# Altium project LPL_Control_board_Rev4.PrjPcb (part 2 of 2)
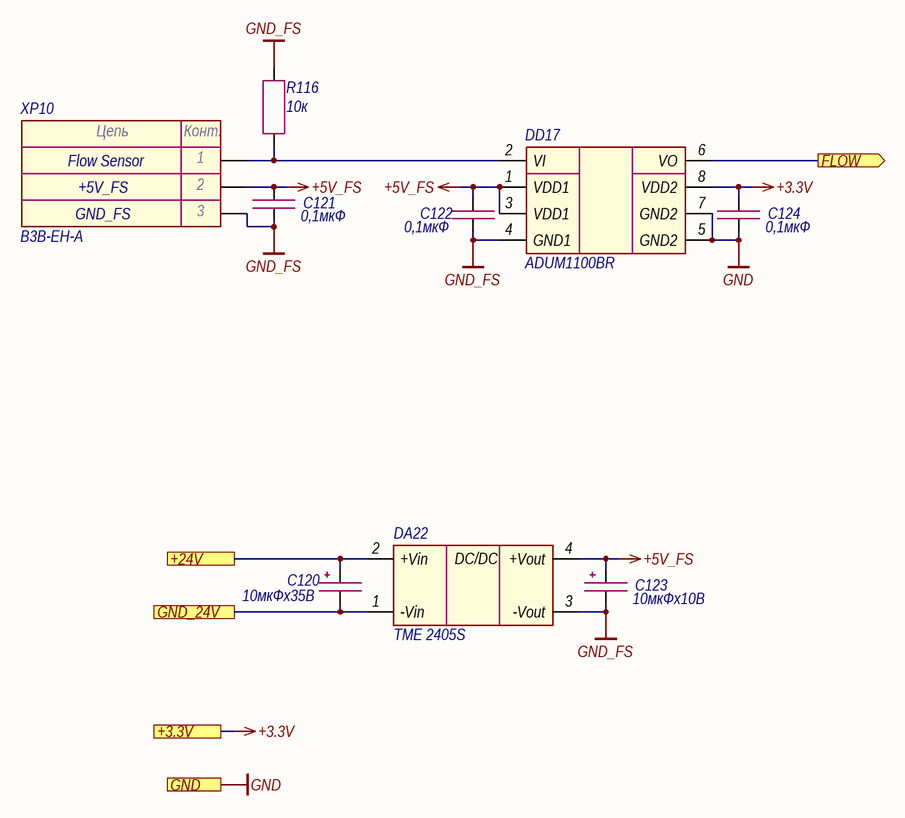
[diagram p10: Flow_sensor.SchDoc]

## Nets that join several sheets
+3.3V: Main (23 pins), Hardwiring (12 pins), Ethernet (10 pins), Power_supply (9 pins), A7 (6 pins), Fiber_interlock (C78.1 DD11.5 R51.2), Flow_sensor (C124.1 DD17.8), A8 (6 pins)
+3.3VA: Main (6 pins), A1 (C34A1.1 C35A1.1 DA5A1.4 R16A1.3), A2 (C34A2.1 C35A2.1 DA5A2.4 R16A2.3), A3 (C34A3.1 C35A3.1 DA5A3.4 R16A3.3)
+5V: Main (8 pins), Guide_laser (5 pins)
+5VA: Main (C3.1 L1.2), Hardwiring (C103.1 C105.1 DA18.2 U5.8), A1 (C30A1.1 C31A1.1 DA4A1.7 DA4A1.8), A7 (C61A7.1 C66A7.1 DA13A7.2 U1A7.8), A2 (C30A2.1 C31A2.1 DA4A2.7 DA4A2.8), A3 (C30A3.1 C31A3.1 DA4A3.7 DA4A3.8), A8 (C61A8.1 C66A8.1 DA13A8.2 U1A8.8)
+24V: Main (C1.1 DA1.2 XP2.1), Indication (XP7.1 XP7.3 XP7.5), Hardwiring (C111.1 DA19.2), Power_supply (C39.1 DA7.2), A7 (C51A7.1 DA11A7.2), Flow_sensor (C120.1 DA22.2), A8 (C51A8.1 DA11A8.2)
-5VA: Main (C11.1 L3.2), A1 (C28A1.2 C29A1.1 DA4A1.4 R10A1.1), A2 (C28A2.2 C29A2.1 DA4A2.4 R10A2.1), A3 (C28A3.2 C29A3.1 DA4A3.4 R10A3.1)
AGND: Main (14 pins), Hardwiring (6 pins), A1 (15 pins), A7 (7 pins), A2 (15 pins), A3 (15 pins), A8 (7 pins)
GND: Main (39 pins), Indication (U2.2 U3.2 U4.2), Hardwiring (15 pins), Ethernet (31 pins), Power_supply (11 pins), A7 (8 pins), Guide_laser (8 pins), Fiber_interlock (C77.2 C78.2 DD11.3 XP8.2), Flow_sensor (C124.2 DD17.5 DD17.7), A8 (8 pins)
GND_24V: Main (C1.2 DA1.1 XP2.2), Indication (U2.3 U3.3 U4.3), Hardwiring (C111.2 DA19.1), Power_supply (C39.2 DA7.1), A7 (C51A7.2 DA11A7.1), Flow_sensor (C120.2 DA22.1), A8 (C51A8.2 DA11A8.1)
CRASH_IND: Main (DD1.3), Indication (R49.2)
DRV1_AN_MOD: Main (DD1.63), A7 (DD9A7.5)
DRV1_CUR: Main (DD1.30), A7 (C72A7.1 R39A7.2)
DRV1_DIG_MOD: Main (DD1.61), A7 (DA10A7.3)
DRV1_ERR1: Main (DD1.55), A7 (DD10A7.7)
DRV1_ERR2: Main (DD1.56), A7 (DD10A7.6)
DRV1_ON: Main (DD1.53), A7 (DD9A7.3)
DRV1_SEL_DIG: Main (DD1.54), A7 (DA10A7.6)
DRV2_AN_MOD: Main (DD1.64), A8 (DD9A8.5)
DRV2_CUR: Main (DD1.31), A8 (C72A8.1 R39A8.2)
DRV2_DIG_MOD: Main (DD1.62), A8 (DA10A8.3)
DRV2_ERR1: Main (DD1.59), A8 (DD10A8.7)
DRV2_ERR2: Main (DD1.60), A8 (DD10A8.6)
DRV2_ON: Main (DD1.57), A8 (DD9A8.3)
DRV2_SEL_DIG: Main (DD1.58), A8 (DA10A8.6)
EMIS_IND: Main (DD1.2), Indication (R48.2)
ETH_CS: Main (DD1.92), Ethernet (DD12.29)
ETH_INT: Main (DD1.88), Ethernet (DD12.47)
ETH_MISO: Main (DD1.90), Ethernet (DD12.33)
ETH_MOSI: Main (DD1.91), Ethernet (DD12.32)
ETH_RST: Main (DD1.93), Ethernet (DD12.48 R66.1)
ETH_SCLK: Main (DD1.89), Ethernet (DD12.30)
EXT_AN_MOD: Main (DD1.32), Hardwiring (C110.1 R94.2)
EXT_COM1: Main (DD1.39), Hardwiring (DD15.13)
EXT_COM2: Main (DD1.41), Hardwiring (DD15.12)
EXT_COM3: Main (DD1.42), Hardwiring (DD15.11)
EXT_DIG_MOD: Main (DD1.40), Hardwiring (DD15.14), Power_supply (DA6.1), A7 (DA10A7.1), A8 (DA10A8.1)
EXT_FLAG1: Main (DD1.43), Hardwiring (R95.2)
EXT_FLAG2: Main (DD1.44), Hardwiring (R96.2)
EXT_FLAG3: Main (DD1.45), Hardwiring (R97.2)
EXT_FLAG4: Main (DD1.46), Hardwiring (R98.2)
EXT_IL1: Main (DD1.33), Hardwiring (R86.2 U6.16)
EXT_IL2: Main (DD1.34), Hardwiring (R87.2 U6.14)
EXT_KEY: Main (DD1.36), Hardwiring (R89.2 U6.12)
EXT_MP_EN: Main (DD1.38), Hardwiring (R91.2 U6.10)
EXT_PMO: Main (DD1.35), Hardwiring (DD16.2)
FIBER_IL: Main (DD1.82), Fiber_interlock (DD11.4)
FLOW: Main (DD1.77), Flow_sensor (DD17.6)
GUIDE_LAS: Main (DD1.4), Guide_laser (R40.1)
PD1_A: Main (XP1.2), A3 (R10A3.2 R11A3.1)
PD1_ADC: Main (DD1.25), A3 (C32A3.1 R14A3.2)
PD1_C: Main (XP1.1), A3 (C27A3.2 DA4A3.2 R9A3.1)
PD1_ERR: Main (DD1.16), A3 (DA5A3.5)
PD2_A: Main (XP1.5), A2 (R10A2.2 R11A2.1)
PD2_ADC: Main (DD1.24), A2 (C32A2.1 R14A2.2)
PD2_C: Main (XP1.4), A2 (C27A2.2 DA4A2.2 R9A2.1)
PD2_ERR: Main (DD1.17), A2 (DA5A2.5)
PD3_A: Main (XP1.8), A1 (R10A1.2 R11A1.1)
PD3_ADC: Main (DD1.23), A1 (C32A1.1 R14A1.2)
PD3_C: Main (XP1.7), A1 (C27A1.2 DA4A1.2 R9A1.1)
PD3_ERR: Main (DD1.18), A1 (DA5A1.5)
POWER_IND: Main (DD1.1), Indication (R47.2)
PS_A: Main (DD1.96), Power_supply (DD3.3)
PS_D: Main (DD1.95), Power_supply (DA6.3)
PS_ERR1: Main (DD1.65), Power_supply (DD5.14)
PS_ERR2: Main (DD1.66), Power_supply (DD5.13)
PS_ERR3: Main (DD1.67), Power_supply (DD5.12)
PS_ON: Main (DD1.68), Power_supply (DD5.11)
PS_SEL_D: Main (DD1.69), Power_supply (DA6.6)
Rx232: Main (DD1.48), Hardwiring (DD14.2)
RxCAN: Main (DD1.70), Power_supply (DD6.5)
Tx232: Main (DD1.47), Hardwiring (DD14.3)
TxCAN: Main (DD1.71), Power_supply (DD6.6)